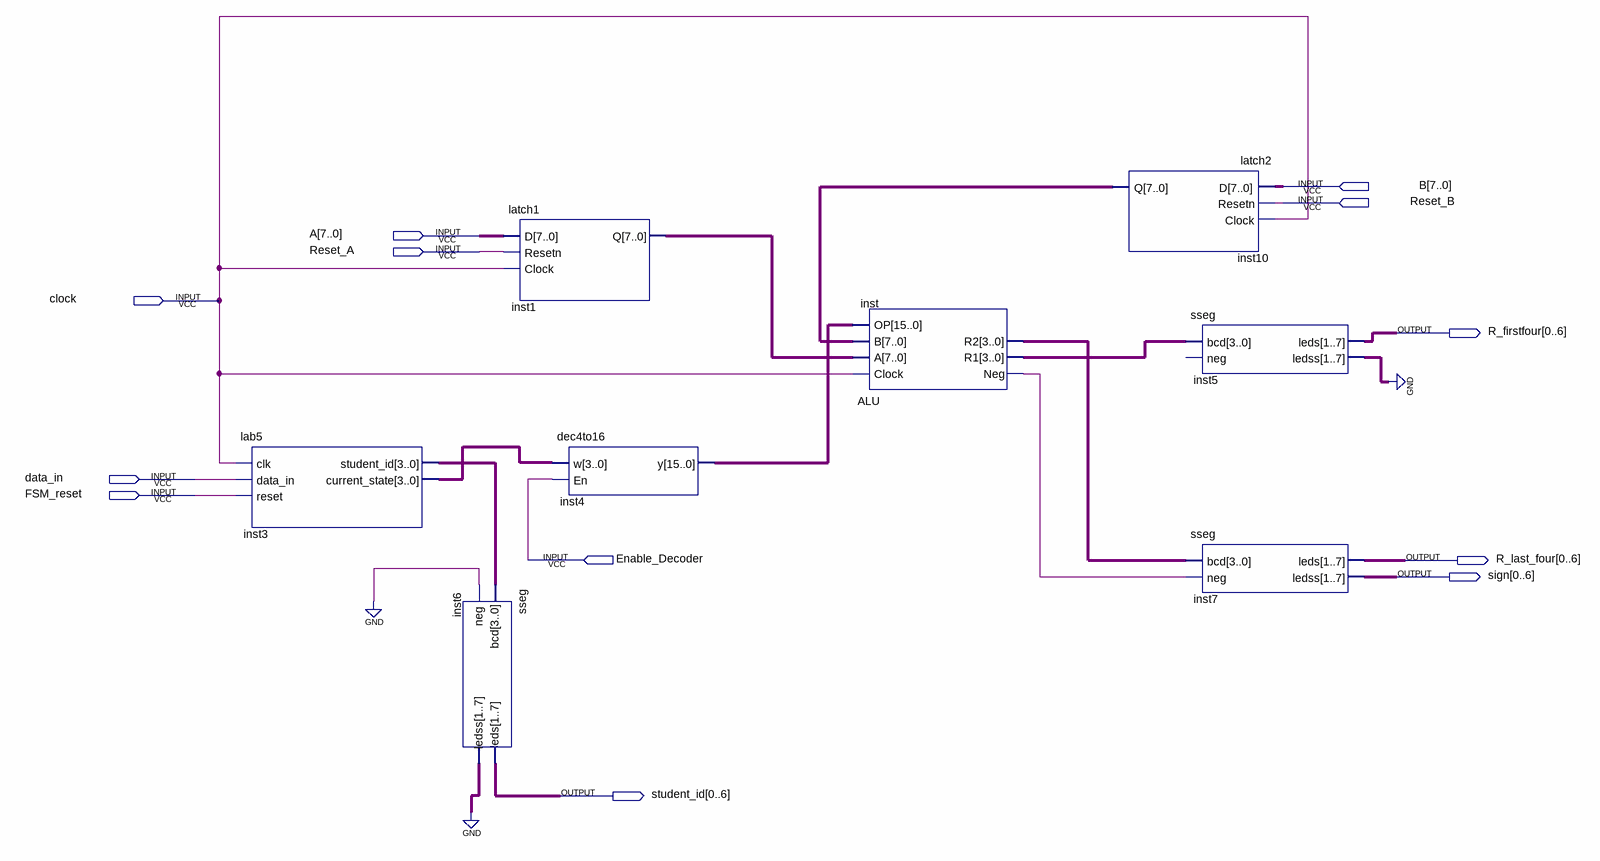
[diagram p0: schematic sheet]
// Quartus schematic p1.bdf as structural Verilog: 8 symbols, 12 pins
module p1 (
  input  [7:0] B,
  input  Reset_B,
  input  [7:0] A,
  input  Reset_A,
  input  clock,
  input  data_in,
  input  FSM_reset,
  input  Enable_Decoder,
  output [0:6] R_firstfour,
  output [0:6] R_last_four,
  output [0:6] sign,
  output [0:6] student_id
);

  wire inst_neg;
  wire [3:0] inst3_current_state, inst3_student_id, inst_r1, inst_r2;
  wire [6:0] inst5_ledss, inst6_ledss;
  wire [7:0] inst1_q, inst10_q;
  wire [15:0] inst4_y;

  lab5 inst3 (
    .clk(clock), .data_in(data_in), .reset(FSM_reset), .student_id(inst3_student_id),
    .current_state(inst3_current_state));
  sseg inst6 (.bcd(inst3_student_id), .neg(1'b0), .leds(student_id), .ledss(inst6_ledss));
  latch1 inst1 (.D(A), .Resetn(Reset_A), .Clock(clock), .Q(inst1_q));
  dec4to16 inst4 (.w(inst3_current_state), .En(Enable_Decoder), .y(inst4_y));
  ALU inst (.Clock(clock), .A(inst1_q), .B(inst10_q), .OP(inst4_y), .Neg(inst_neg), .R1(inst_r1), .R2(inst_r2));
  latch2 inst10 (.D(B), .Resetn(Reset_B), .Clock(clock), .Q(inst10_q));
  sseg inst5 (.bcd(inst_r1), .leds(R_firstfour), .ledss(inst5_ledss));  // open: neg
  sseg inst7 (.bcd(inst_r2), .neg(inst_neg), .leds(R_last_four), .ledss(sign));
  // also tied to GND on the sheet: {inst6_ledss[0], inst6_ledss[1], inst6_ledss[2], inst6_ledss[3], inst6_ledss[4], inst6_ledss[5], inst6_ledss[6], inst5_ledss[0], inst5_ledss[1], inst5_ledss[2], inst5_ledss[3], inst5_ledss[4], inst5_ledss[5], inst5_ledss[6]}
endmodule
